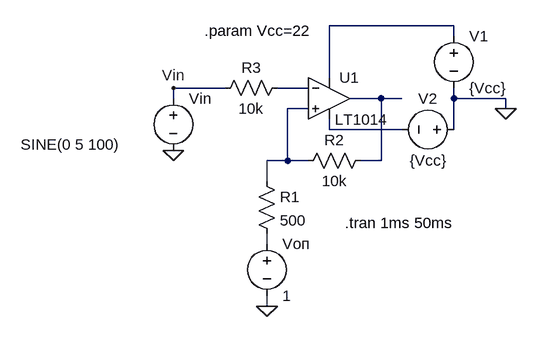
[diagram p0: schematic scheme9.asc]
scheme9.asc, the LTspice schematic file:
Version 4.1
SHEET 1 996 680
WIRE 400 -96 208 -96
WIRE 400 -80 400 -96
WIRE 208 -16 208 -96
WIRE 48 0 -32 0
WIRE 176 0 128 0
WIRE -32 16 -32 0
WIRE 288 16 240 16
WIRE 320 16 288 16
WIRE 400 16 400 0
WIRE 480 16 400 16
WIRE 176 32 144 32
WIRE 480 32 480 16
WIRE 208 64 208 48
WIRE 320 64 208 64
WIRE 400 64 400 16
WIRE 144 112 144 32
WIRE 144 112 112 112
WIRE 176 112 144 112
WIRE 288 112 288 16
WIRE 288 112 256 112
WIRE 112 144 112 112
WIRE 112 240 112 224
WIRE 112 336 112 320
FLAG 112 336 0
FLAG -32 96 0
FLAG 480 32 0
FLAG -32 0 Vin
SYMBOL res 96 128 R0
SYMATTR InstName R1
SYMATTR Value 500
SYMBOL res 272 96 R90
WINDOW 0 0 56 VBottom 2
WINDOW 3 32 56 VTop 2
SYMATTR InstName R2
SYMATTR Value 10k
SYMBOL res 144 -16 R90
WINDOW 0 0 56 VBottom 2
WINDOW 3 32 56 VTop 2
SYMATTR InstName R3
SYMATTR Value 10k
SYMBOL OpAmps\\LT1014 208 -48 R0
WINDOW 3 9 97 Left 2
SYMATTR InstName U1
SYMBOL voltage 400 -96 R0
SYMATTR InstName V1
SYMATTR Value {Vcc}
SYMBOL voltage 416 64 R90
WINDOW 0 -32 56 VBottom 2
WINDOW 3 32 56 VTop 2
SYMATTR InstName V2
SYMATTR Value {Vcc}
SYMBOL voltage 112 224 R0
SYMATTR InstName Vоп
SYMATTR Value 1
SYMBOL voltage -32 0 R0
WINDOW 3 -235 87 Left 2
SYMATTR Value SINE(0 5 100)
SYMATTR InstName Vin
TEXT 16 -88 Left 2 !.param Vcc=22
TEXT 232 208 Left 2 !.tran 1ms 50ms

The netlist it stands for:
* scheme9.asc
R1 N004 N006 500
R2 N003 N004 10k
R3 N002 Vin 10k
X§U1 N004 N002 N001 N005 N003 LT1014  ; pins In+ In- V+ V- OUT
V1 N001 0 {Vcc}
V2 0 N005 {Vcc}
Vоп N006 0 1
Vin Vin 0 SINE(0 5 100)
.param Vcc=22
.tran 1ms 50ms
.backanno
.end